# EAGLE design AOA-sensor-board (EAGLE 8.2.1)
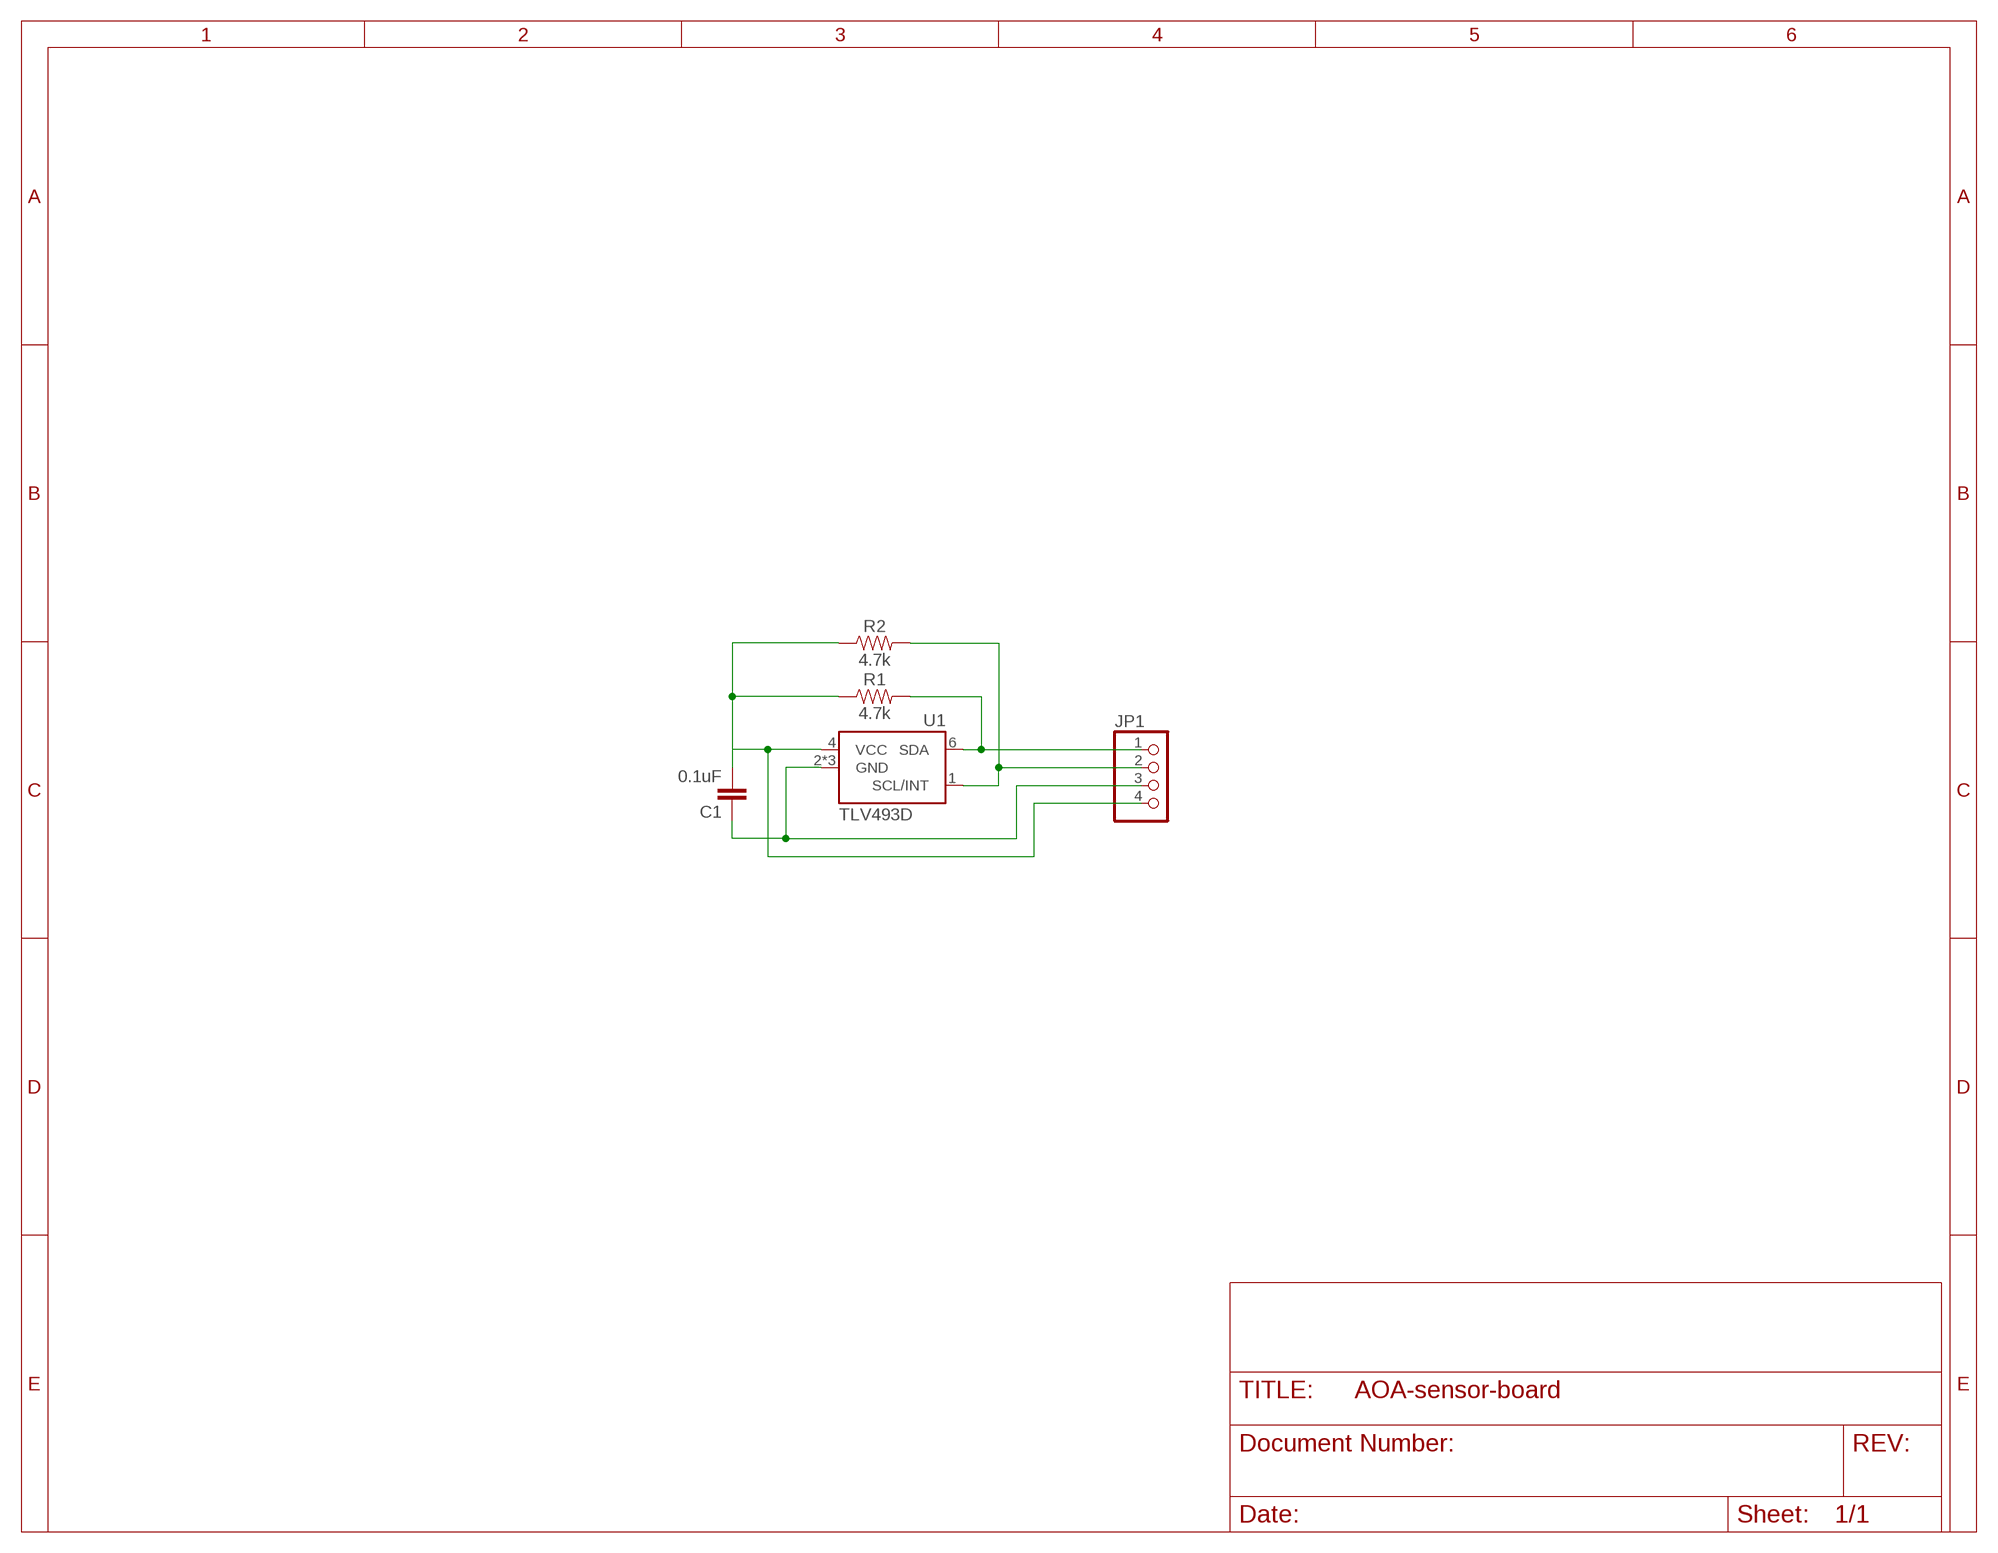
[diagram p0: schematic, sheet 1]

## Parts
C1  0.1uF  0.1UF-0603-25V-(+80/-20%)  [0603]
JP1  PINHD-1X4  [1X04]
R1  4.7k  4.7KOHM-0603-1/10W-1%  [0603]
R2  4.7k  4.7KOHM-0603-1/10W-1%  [0603]
U1  TLV493D  [TSOP-6]

## Nets
GND: C1.1 JP1.3 U1.2(GND) U1.3(GND) U1.5(GND)
SCL: JP1.2 R2.2 U1.1(SCL/INT)
SDA: JP1.1 R1.2 U1.6(SDA)
VCC: C1.2 JP1.4 R1.1 R2.1 U1.4(VCC)

## Library data of the parts
C1 = SparkFun-Capacitors:0.1UF: 0.1µF ceramic capacitors A capacitor is a passive two-terminal electrical component used to store electrical energy temporarily in an electric field.; PROD_ID: CAP-00810
JP1 = pinhead:PINHD-1X4: PIN HEADER
R1 R2 = SparkFun-Resistors:4.7KOHM: 4.7kΩ resistor A resistor is a passive two-terminal electrical component that implements electrical resistance as a circuit element. Resistors act to reduce current flow, and, at the same time, act to lower voltage levels within circuits. - Wikipedia; PROD_ID: RES-07857
U1 = logos-sensors:TLV493D

## Board
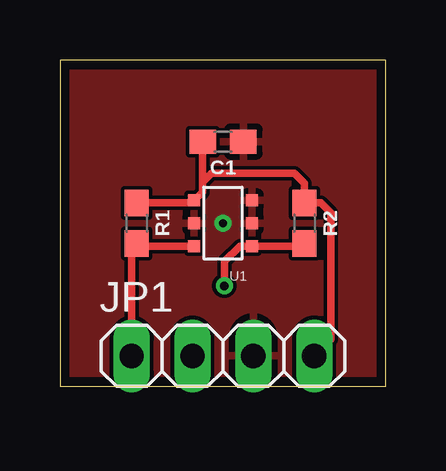
[diagram p1: board, top side]
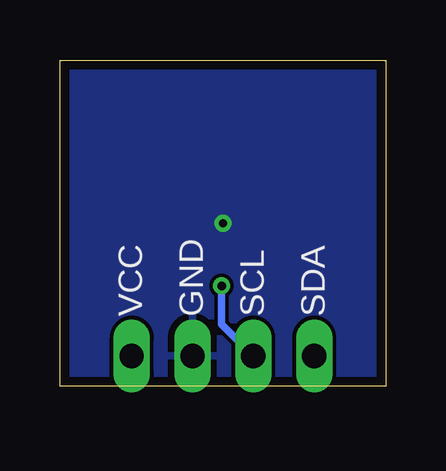
[diagram p2: board, bottom side, seen from below]

Size 13.6 x 13.6 mm. Coordinates in mm from the lower left corner, seen from the top.
Outline: 0,0 13.6,0 13.6,13.6 0,13.6 0,0
Copper layers (1*16): Top 0.0356mm / dielectric 1.5011mm / Bottom 0.0356mm
Design rules "LaenPCBOrder": minimum track width 6mil, minimum drill 13mil, track to track 6mil, track to pad 6mil, pad to pad 6mil, via to via 6mil, smd to smd 6mil, copper to edge 15mil, drill to drill 6mil, minimum pad ring 7mil, minimum via ring 7mil, stop-mask expansion 4mil, vias tented up to drill 0mil, thermal gap 10mil

### Footprints (pad centres in the part's own frame; a part is rotated, then mirrored left to right if it is on the bottom)
0603 = smd 1.1 x 1: 1 -0.85,0; 2 0.85,0
1X04 = drill 1.016 long: 1 -3.81,0; 2 -1.27,0; 3 1.27,0; 4 3.81,0
TSOP-6 = smd 0.5 x 0.5: 1 -0.95,-1.2; 2 0,-1.2; 3 0.95,-1.2; 4 0.95,1.2; 5 0,1.2; 6 -0.95,1.2

### Placement (x,y rotation side)
C1  6.8,10.2 180 top
JP1  6.8,1.27 0 top
R1  3.2,6.8 270 top
R2  10.2,6.8 270 top
U1  6.8,6.8 90 top

### Tracks (layer width: path | path; a pad name or v marks a point on that pad's centre or on a via)
GND  (via drill 0.35)
  other vias: 6.8,6.8
  pour Top: 0,0 13.97,0 13.97,13.97 0,13.97
  pour Bottom: 0,0 15.24,0 15.24,15.24 0,15.24
SCL  (via drill 0.35)
  Top 0.305: R2.2 10.1,5.85 U1.1 7.5,5.85 6.86,5.21 v6.86,4.19
  Bottom 0.305: v6.86,4.19 6.86,2.6 JP1.2
SDA
  Top 0.305: JP1.1 2.99,5.74 R1.2 3.3,5.85 U1.6
VCC
  Top 0.305: R1.1 5.5,7.65 U1.4 5.95,8.1 5.95,8.51 | 5.95,8.51 C1.2 | JP1.4 11.3,1.96 11.3,7.24 10.89,7.65 R2.1 10.2,8.47 9.78,8.89 6.33,8.89 5.95,8.51

### Text on the board
bPlace: SDA | SCL | GND | VCC